# EAGLE design click sensor hub 2019 (EAGLE 9.3.0)

## Sheet 1 of 2
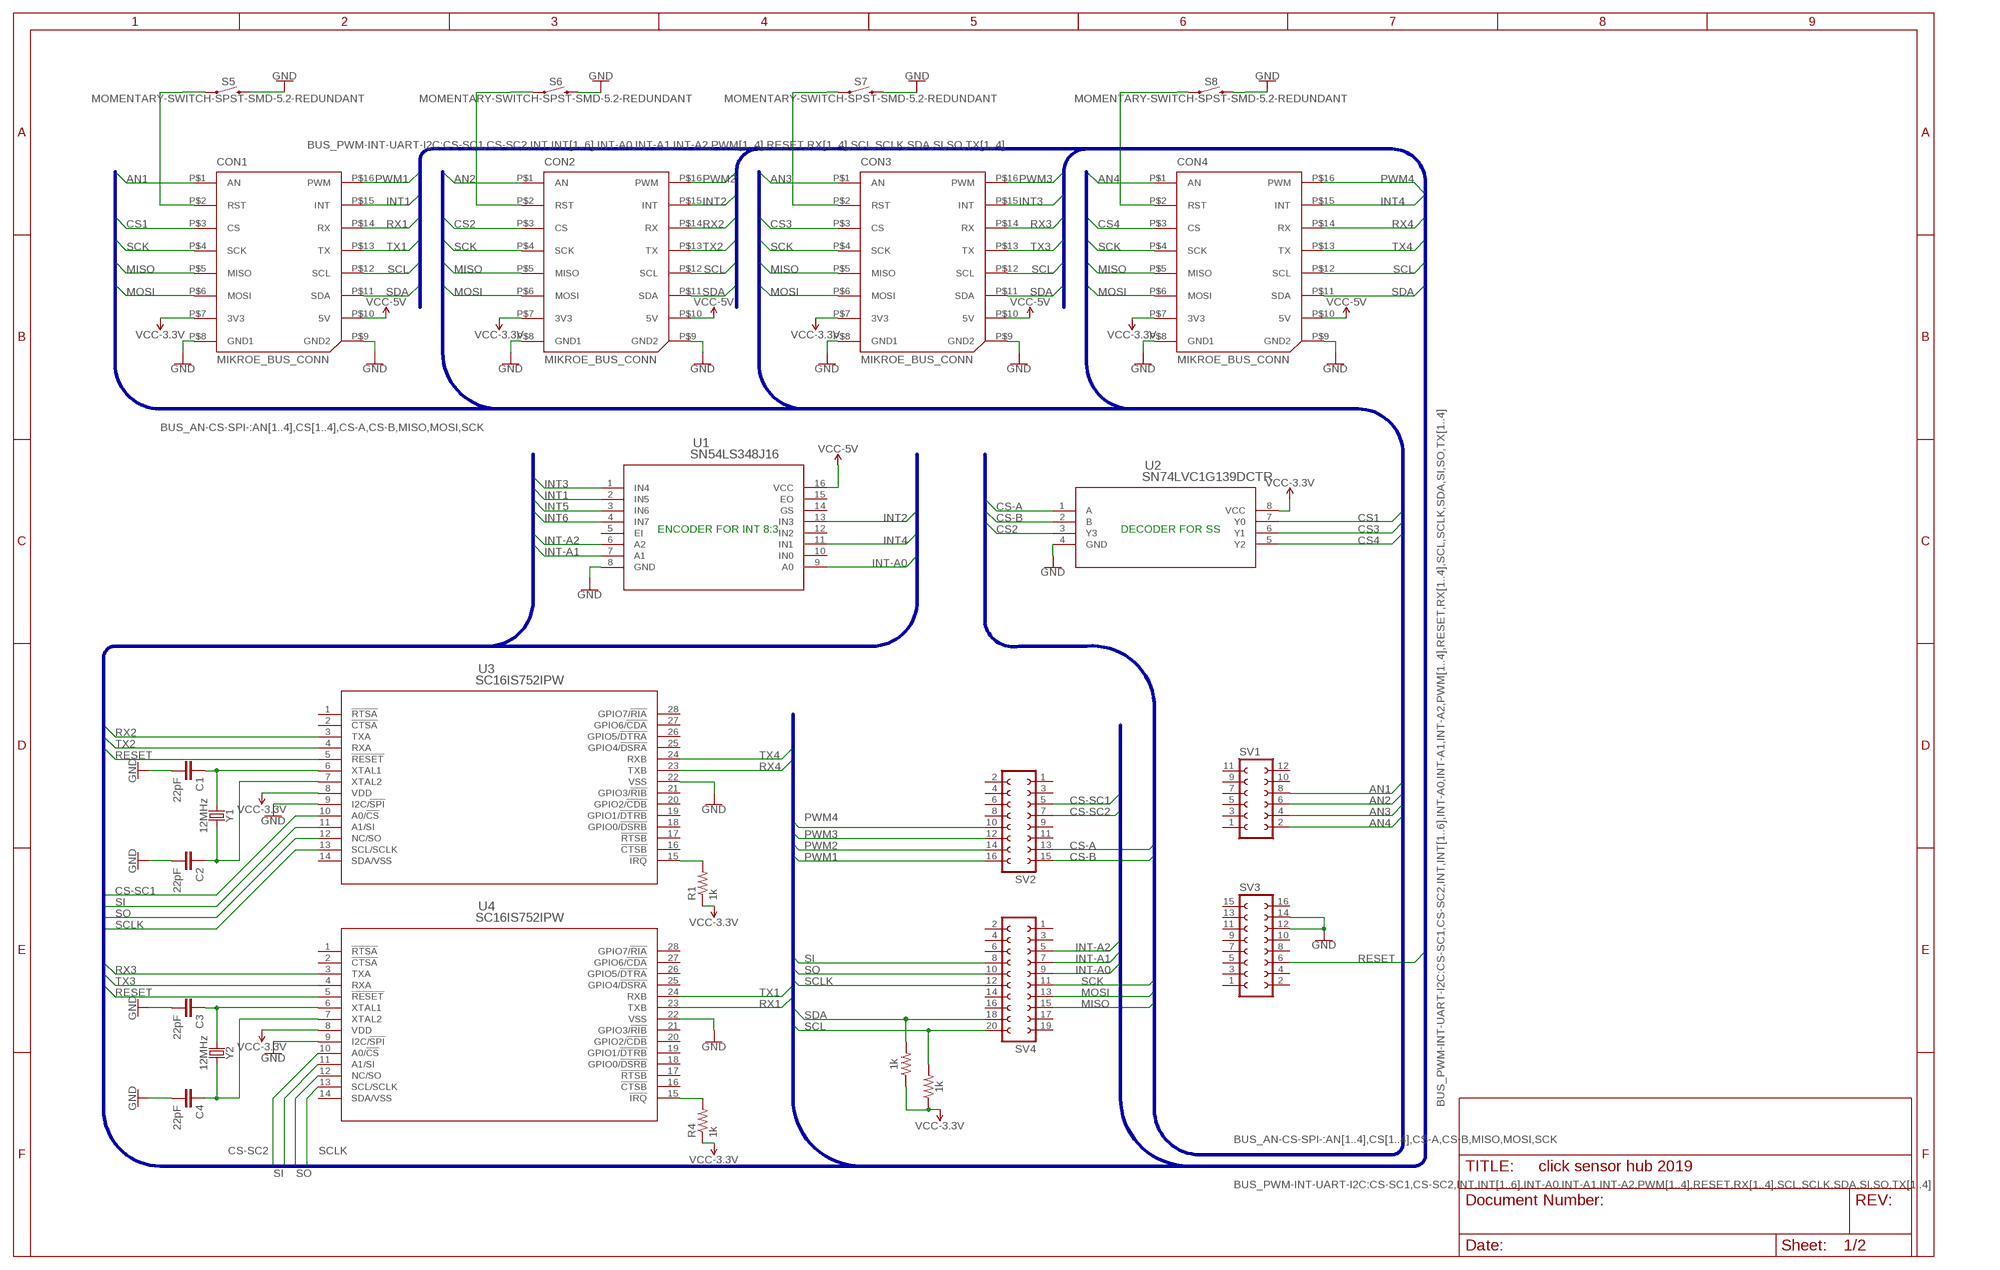
[diagram p0: schematic, sheet 1]

### Parts
C1  22pF  22PF-0603-50V-5%  [0603]
C2  22pF  22PF-0603-50V-5%  [0603]
C3  22pF  22PF-0603-50V-5%  [0603]
C4  22pF  22PF-0603-50V-5%  [0603]
CON1  MIKROE_BUS_CONN  [MIKROBUS_HOST_CONN]
CON2  MIKROE_BUS_CONN  [MIKROBUS_HOST_CONN]
CON3  MIKROE_BUS_CONN  [MIKROBUS_HOST_CONN]
CON4  MIKROE_BUS_CONN  [MIKROBUS_HOST_CONN]
R1  1k  R-US_R0805  [R0805]
R2  1k  R-US_R0805  [R0805]
R3  1k  R-US_R0805  [R0805]
R4  1k  R-US_R0805  [R0805]
S5  MOMENTARY-SWITCH-SPST-SMD-5.2-REDUNDANT  [TACTILE_SWITCH_SMD_5.2MM]
S6  MOMENTARY-SWITCH-SPST-SMD-5.2-REDUNDANT  [TACTILE_SWITCH_SMD_5.2MM]
S7  MOMENTARY-SWITCH-SPST-SMD-5.2-REDUNDANT  [TACTILE_SWITCH_SMD_5.2MM]
S8  MOMENTARY-SWITCH-SPST-SMD-5.2-REDUNDANT  [TACTILE_SWITCH_SMD_5.2MM]
SV1  FE06-2  [FE06-2]
SV2  FE08-2  [FE08-2]
SV3  FE08-2  [FE08-2]
SV4  FE10-2  [FE10-2]
U1  SN54LS348J16  [DIP16_300]
U2  SN74LVC1G139DCTR  [DCT8]
U3  SC16IS752IPW  [SOT361-1]
U4  SC16IS752IPW  [SOT361-1]
Y1  12MHz  CRYSTAL-12MHZ"  [CRYSTAL-SMD-5X3.2-4PAD]
Y2  12MHz  CRYSTAL-12MHZ"  [CRYSTAL-SMD-5X3.2-4PAD]

### Nets
3.3V: CON1.P$7(3V3) CON2.P$7(3V3) CON3.P$7(3V3) CON4.P$7(3V3) ; supply symbol labelled VCC-3.3V ; also sheet 2
5V: CON1.P$10(5V) CON2.P$10(5V) CON3.P$10(5V) CON4.P$10(5V) ; supply symbol labelled VCC-5V ; also sheet 2
AN1: CON1.P$1(AN) SV1.8
AN2: CON2.P$1(AN) SV1.6
AN3: CON3.P$1(AN) SV1.4
AN4: CON4.P$1(AN) SV1.2
CS1: CON1.P$3(CS) U2.7(Y0)
CS2: CON2.P$3(CS) U2.3(Y3)
CS3: CON3.P$3(CS) U2.6(Y1)
CS4: CON4.P$3(CS) U2.5(Y2)
CS-A: SV2.13 U2.1(A)
CS-B: SV2.15 U2.2(B)
CS-SC1: SV2.5 U3.10(A0/!CS)
CS-SC2: SV2.7 U4.10(A0/!CS)
GND: C1.2 C2.2 C3.2 C4.2 CON1.P$8(GND1) CON1.P$9(GND2) CON2.P$8(GND1) CON2.P$9(GND2) CON3.P$8(GND1) CON3.P$9(GND2) CON4.P$8(GND1) CON4.P$9(GND2) S5.3 S5.4 S6.3 S6.4 S7.3 S7.4 S8.3 S8.4 SV3.12 SV3.14 U1.8(GND) U2.4(GND) U3.9(I2C/!SPI) U3.22(VSS) U4.9(I2C/!SPI) U4.22(VSS) ; also sheet 2
INT1: CON1.P$15(INT) U1.2(IN5)
INT2: CON2.P$15(INT) U1.13(IN3)
INT3: CON3.P$15(INT) U1.1(IN4)
INT4: CON4.P$15(INT) U1.11(IN1)
INT5: R1.2 U1.3(IN6) U3.15(!IRQ)
INT6: R4.2 U1.4(IN7) U4.15(!IRQ)
INT-A0: SV4.9 U1.9(A0)
INT-A1: SV4.7 U1.7(A1)
INT-A2: SV4.5 U1.6(A2)
MISO: CON1.P$5(MISO) CON2.P$5(MISO) CON3.P$5(MISO) CON4.P$5(MISO) SV4.15
MOSI: CON1.P$6(MOSI) CON2.P$6(MOSI) CON3.P$6(MOSI) CON4.P$6(MOSI) SV4.13
N$8: C1.1 U3.6(XTAL1) Y1.1
N$9: C2.1 U3.7(XTAL2) Y1.3
N$10: C3.1 U4.6(XTAL1) Y2.1
N$11: CON4.P$2(RST) S8.1 S8.2
N$12: C4.1 U4.7(XTAL2) Y2.3
N$15: CON1.P$2(RST) S5.1 S5.2
N$16: CON2.P$2(RST) S6.1 S6.2
N$18: CON3.P$2(RST) S7.1 S7.2
PWM1: CON1.P$16(PWM) SV2.16
PWM2: CON2.P$16(PWM) SV2.14
PWM3: CON3.P$16(PWM) SV2.12
PWM4: CON4.P$16(PWM) SV2.10
RESET: SV3.6 U3.5(!RESET) U4.5(!RESET)
RX1: CON1.P$14(RX) U4.23(TXB)
RX2: CON2.P$14(RX) U3.3(TXA)
RX3: CON3.P$14(RX) U4.3(TXA)
RX4: CON4.P$14(RX) U3.23(TXB)
SCK: CON1.P$4(SCK) CON2.P$4(SCK) CON3.P$4(SCK) CON4.P$4(SCK) SV4.11
SCL: CON1.P$12(SCL) CON2.P$12(SCL) CON3.P$12(SCL) CON4.P$12(SCL) R3.2 SV4.20
SCLK: SV4.12 U3.13(SCL/SCLK) U4.13(SCL/SCLK)
SDA: CON1.P$11(SDA) CON2.P$11(SDA) CON3.P$11(SDA) CON4.P$11(SDA) R2.2 SV4.18
SI: SV4.8 U3.11(A1/SI) U4.11(A1/SI)
SO: SV4.10 U3.12(NC/SO) U4.12(NC/SO)
TX1: CON1.P$13(TX) U4.24(RXB)
TX2: CON2.P$13(TX) U3.4(RXA)
TX3: CON3.P$13(TX) U4.4(RXA)
TX4: CON4.P$13(TX) U3.24(RXB)
VCC: U1.16(VCC) U2.8(VCC) ; supply symbol labelled VCC-3.3V, VCC-5V
VDD: R1.1 R2.1 R3.1 R4.1 U3.8(VDD) U4.8(VDD) ; supply symbol labelled VCC-3.3V
Unconnected: SV1.1 SV1.3 SV1.5 SV1.7 SV1.9 SV1.10 SV1.11 SV1.12 SV2.1 SV2.2 SV2.3 SV2.4 SV2.6 SV2.8 SV2.9 SV2.11 SV3.1 SV3.2 SV3.3 SV3.4 SV3.5 SV3.7 SV3.8 SV3.9 SV3.10 SV3.11 SV3.13 SV3.15 SV3.16 SV4.1 SV4.2 SV4.3 SV4.4 SV4.6 SV4.14 SV4.16 SV4.17 SV4.19 U1.5(EI) U1.10(IN0) U1.12(IN2) U1.14(GS) U1.15(EO) U3.1(!RTSA) U3.2(!CTSA) U3.14(SDA/VSS) U3.16(!CTSB) U3.17(!RTSB) U3.18(GPIO0/!DSRB) U3.19(GPIO1/!DTRB) U3.20(GPIO2/!CDB) U3.21(GPIO3/!RIB) U3.25(GPIO4/!DSRA) U3.26(GPIO5/!DTRA) U3.27(GPIO6/!CDA) U3.28(GPIO7/!RIA) U4.1(!RTSA) U4.2(!CTSA) U4.14(SDA/VSS) U4.16(!CTSB) U4.17(!RTSB) U4.18(GPIO0/!DSRB) U4.19(GPIO1/!DTRB) U4.20(GPIO2/!CDB) U4.21(GPIO3/!RIB) U4.25(GPIO4/!DSRA) U4.26(GPIO5/!DTRA) U4.27(GPIO6/!CDA) U4.28(GPIO7/!RIA)

### Buses
BUS_PWM-INT-UART-I2C:CS-SC1,CS-SC2,INT,INT[1..6],INT-A0,INT-A1,INT-A2,PWM[1..4],RESET,RX[1..4],SCL,SCLK,SDA,SI,SO,TX[1..4]
BUS_AN-CS-SPI-:AN[1..4],CS[1..4],CS-A,CS-B,MISO,MOSI,SCK

### Notes on the sheet
- ENCODER FOR INT 8:3 | DECODER FOR SS

## Sheet 2 of 2
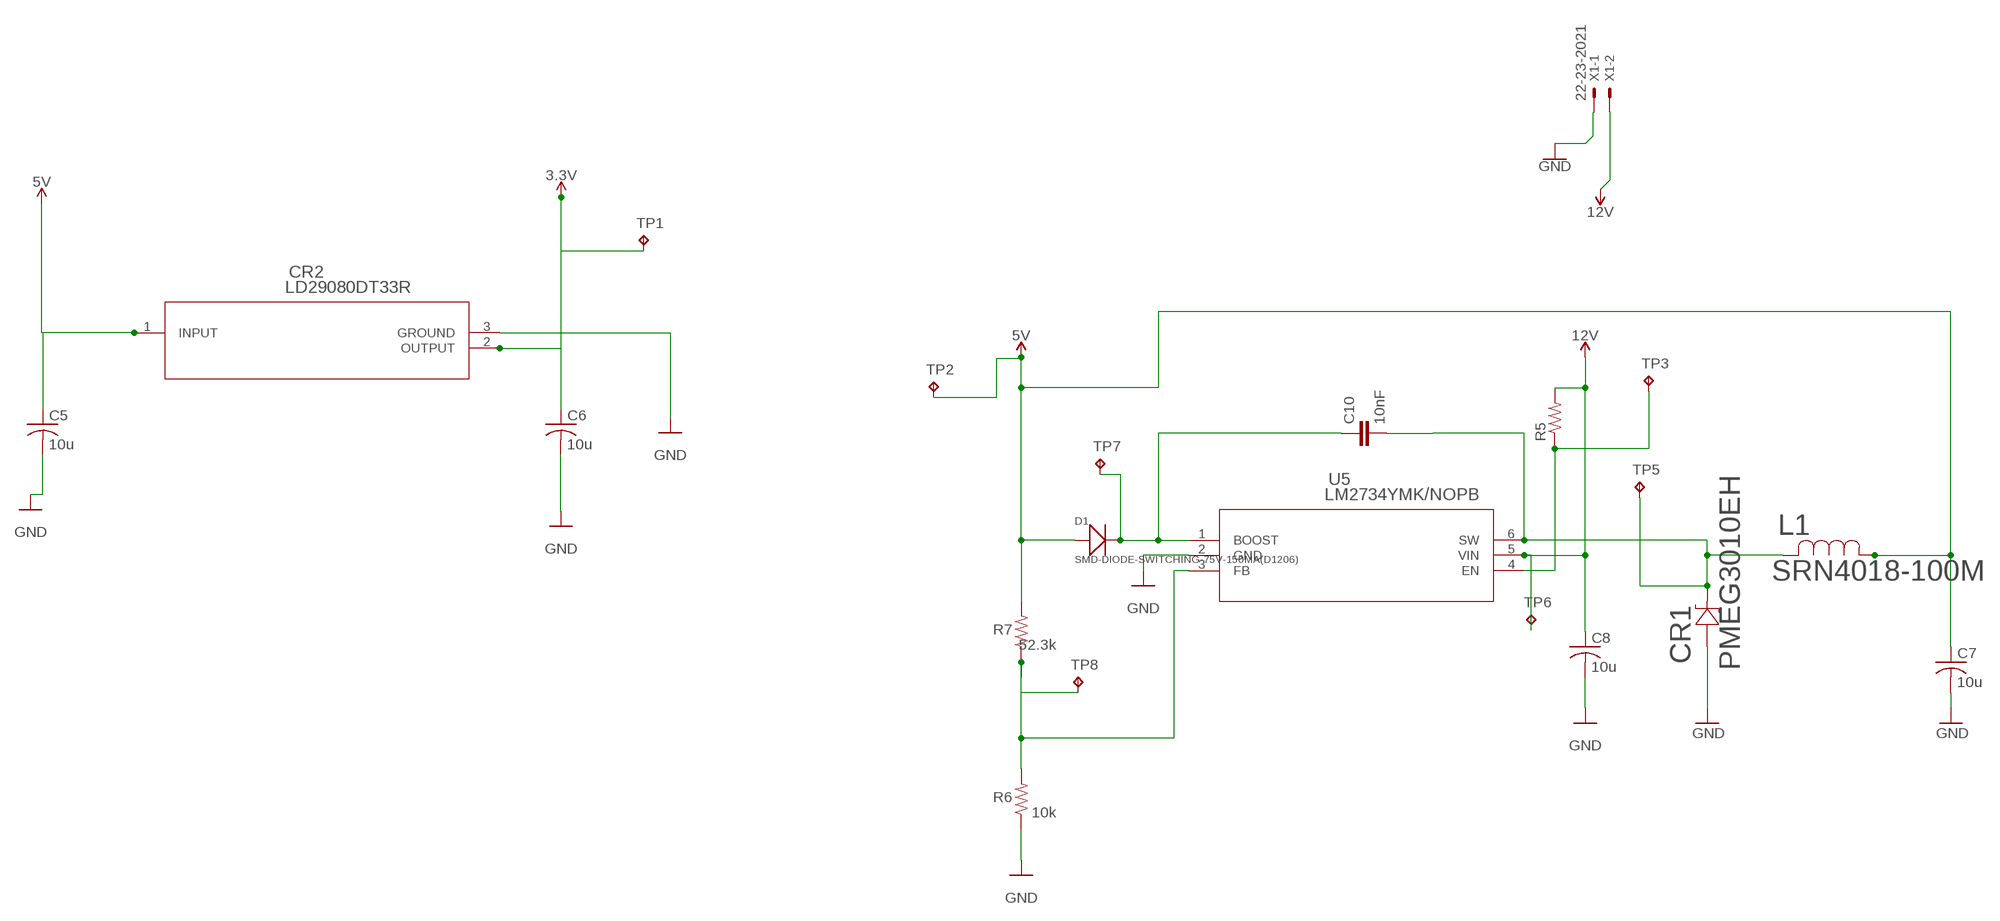
[diagram p1: schematic, sheet 2]

### Parts
C5  10u  C-USC0603K  [C0603K]
C6  10u  C-USC0603K  [C0603K]
C7  10u  C-USC0603K  [C0603K]
C8  10u  C-USC0603K  [C0603K]
C10  10nF  10NF-0603-50V-10%  [0603]
CR1  PMEG3010EH  [SOD123F]
CR2  LD29080DT33R  [DPAK]
D1  SMD-DIODE-SWITCHING-75V-150MA(D1206)  [LED-1206]
L1  SRN4018-100M  [IND_BOURNS_SRN4018]
R5  R-US_R0603  [R0603]
R6  10k  R-US_R0603  [R0603]
R7  52.3k  R-US_R0603  [R0603]
TP1  TPTP20SQ  [TP20SQ]
TP2  TPTP20SQ  [TP20SQ]
TP3  TPTP14SQ  [TP14SQ]
TP5  TPTP07SQ  [TP07SQ]
TP6  TPTP15SQ  [TP15SQ]
TP7  TPTP08SQ  [TP08SQ]
TP8  TPTP09SQ  [TP09SQ]
U5  LM2734YMK/NOPB  [MK06A]
X1  22-23-2021  [22-23-2021]

### Nets
3.3V: C6.1 CR2.2(OUTPUT) TP1.TP ; also sheet 1
5V: C5.1 C7.1 CR2.1(INPUT) D1.+ L1.1 R7.2 TP2.TP ; also sheet 1
12V: C8.1 R5.2 TP6.TP U5.5(VIN) X1.2
GND: C5.2 C6.2 C7.2 C8.2 CR1.2 CR2.3(GROUND) R6.1 U5.2(GND) X1.1 ; also sheet 1
N$1: R5.1 TP3.TP U5.4(EN)
N$3: C10.1 D1.- TP7.TP U5.1(BOOST)
N$4: R6.2 R7.1 TP8.TP U5.3(FB)
N$14: C10.2 CR1.1 L1.2 TP5.TP U5.6(SW)

## Library data of the parts
C1-C4 = SparkFun-Capacitors:22PF: 22pF ceramic capacitors A capacitor is a passive two-terminal electrical component used to store electrical energy temporarily in an electric field.; PROD_ID: CAP-07876
C5-C8 = rcl:C-US: CAPACITOR, American symbol; SPICEPREFIX: C
C10 = SparkFun-Capacitors:10NF: 0.01uF/10nF/10,000pF ceramic capacitors A capacitor is a passive two-terminal electrical component used to store electrical energy temporarily in an electric field. CAP-09321; PROD_ID: CAP-00867
CON1-CON4 = mikrobus_lib:MIKROE_BUS_CONN
CR1 = PMEG3010ER:PMEG3010EH: Schottky Diodes & Rectifiers; MANUFACTURER_PART_NUMBER: PMEG3010EH; VENDOR: Nexperia
CR2 = LD2908 DC to DC :LD29080DT33R; MANUFACTURER_PART_NUMBER: LD29080DT33R; VENDOR: STMicroelectronics
D1 = SMD-DIODE-SWITCHING-75V-150MA_D1206_:SMD-DIODE-SWITCHING-75V-150MA(D1206): 304040005; AVAILABILITY: Unavailable; DESCRIPTION: Diode Small Signal Switching 100V 0.15A 2-Pin Case 1206; MF: Bourns; MP: CD1206-S01575; PACKAGE: 1206 Bourns; PRICE: None
L1 = inductors DC DC:SRN4018-100M; MANUFACTURER_PART_NUMBER: SRN4018100M; VENDOR: Bourns Electronics
R1-R4 = adafruit:R-US_: RESISTOR, American symbol
R5-R7 = rcl:R-US_: RESISTOR, American symbol; SPICEPREFIX: R
S5-S8 = SparkFun-Switches:MOMENTARY-SWITCH-SPST: Momentary Switch (Pushbutton) - SPST Normally-open (NO) SPST momentary switches (buttons, pushbuttons). Variants PTH-12MM - 12mm square, through-hole Momentary Pushbutton Switch - 12mm Square <https://www.sparkfun.com/products/9190> (COM-09190) PTH-6.0MM, PTH-6.0MM-KIT - 6.0mm square, through-hole Mini Pushbutton Switch <https://www.sparkfun.com/products/97> (COM-00097) KIT package intended for soldering kit's - only one side of pads' copper is exposed. PTH-RIGHT-ANGLE-KIT - Right-angle, through-hole Right Angle Tactile Button <https://www.sparkfun.com/products/10791> - Used on SparkFun BigTime Watch Kit <https://www.sparkfun.com/products/11734> SMD-12MM - 12mm square, surface-mount Tactile Button - SMD (12mm) <https://www.sparkfun.com/products/12993> (COM-12993) Used on SparkFun PicoBoard <https://www.sparkfun.com/products/11888> SMD-4.5MM - 4.5mm Square Trackball Switch Used on SparkFun Blackberry Trackballer Breakout <https://www.sparkfun.com/products/13169> SMD-4.6MMX2.8MM - 4.60mm x 2.80mm, surface mount Used on SparkFun SAMD21 Mini Breakout <https://www.sparkfun.com/products/13664> SMD-5.2MM, SMD-5.2-REDUNDANT - 5.2mm square, surface-mount Mini Pushbutton Switch - SMD <https://www.sparkfun.com/products/8720> (COM-08720) Used on Arduino Pro Mini <https://www.sparkfun.com/products/11114> REDUNDANT package connects both switch circuits together SMD-6.0X3.5MM - 6.0 x 3.5mm, surface mount Momentary Reset Switch SMD <https://www.sparkfun.com/products/8229> (COM-08229) SMD-6.2MM-TALL - 6.2mm square, surface mount Tactile Button - SMD (6mm) <https://www.sparkfun.com/products/12992> Used on SparkFun Digital Sandbox <https://www.sparkfun.com/products/12651> SMD-RIGHT-ANGLE - Right-angle, surface mount Used on SparkFun Block for Intel® Edison - Arduino <https://www.sparkfun.com/products/13036>; PROD_ID: SWCH-08247; SF_SKU: COM-08720
SV1 = con-lsta:FE06-2: FEMALE HEADER; OC_FARNELL: unknown; OC_NEWARK: unknown
SV2 SV3 = con-lsta:FE08-2: FEMALE HEADER; OC_FARNELL: unknown; OC_NEWARK: unknown
SV4 = con-lsta:FE10-2: FEMALE HEADER; OC_FARNELL: unknown; OC_NEWARK: unknown
TP1-TP3 TP5-TP8 = testpad:TP: Test pad
U1 = Priority_Encoder:SN54LS348J16: Priority Encoder 8 to 3; MANUFACTURER_PART_NUMBER: SN54LS348J16; VENDOR: Texas Instruments
U2 = Decoder_2_4:SN74LVC1G139DCTR: Decoder 2:4; MANUFACTURER_PART_NUMBER: SN74LVC1G139DCTR; VENDOR: Texas Instruments
U3 U4 = SC16IS752IPWSOT:SC16IS752IPW: Bridge from SPI to UART; MANUFACTURER_PART_NUMBER: SC16IS752IPW; VENDOR: NXP
U5 = LM2744:LM2734YMK/NOPB: Voltage regulator 5v; MANUFACTURER_PART_NUMBER: LM2734YMKNOPB; VENDOR: Texas Instruments
X1 = con-molex:22-23-2021: .100" (2.54mm) Center Header - 2 Pin; MF: MOLEX; MPN: 22-23-2021; OC_FARNELL: 1462926; OC_NEWARK: 25C3832
Y1 Y2 = SparkFun-Clocks:CRYSTAL-12MHZ: 12.0MHz Crystal Frequency: 12.0MHz Frequency Tolerance: ±20ppm Load Capacitance: 18pF SparkFun Products: SparkFun Logomatic <https://www.sparkfun.com/products/12772> Pocket AVR Programmer <https://www.sparkfun.com/products/9825>; PROD_ID: XTAL-08297

## Net classes
0 default: width 0.305 mm, drill 0.508 mm, clearance 0.254 mm

## Board
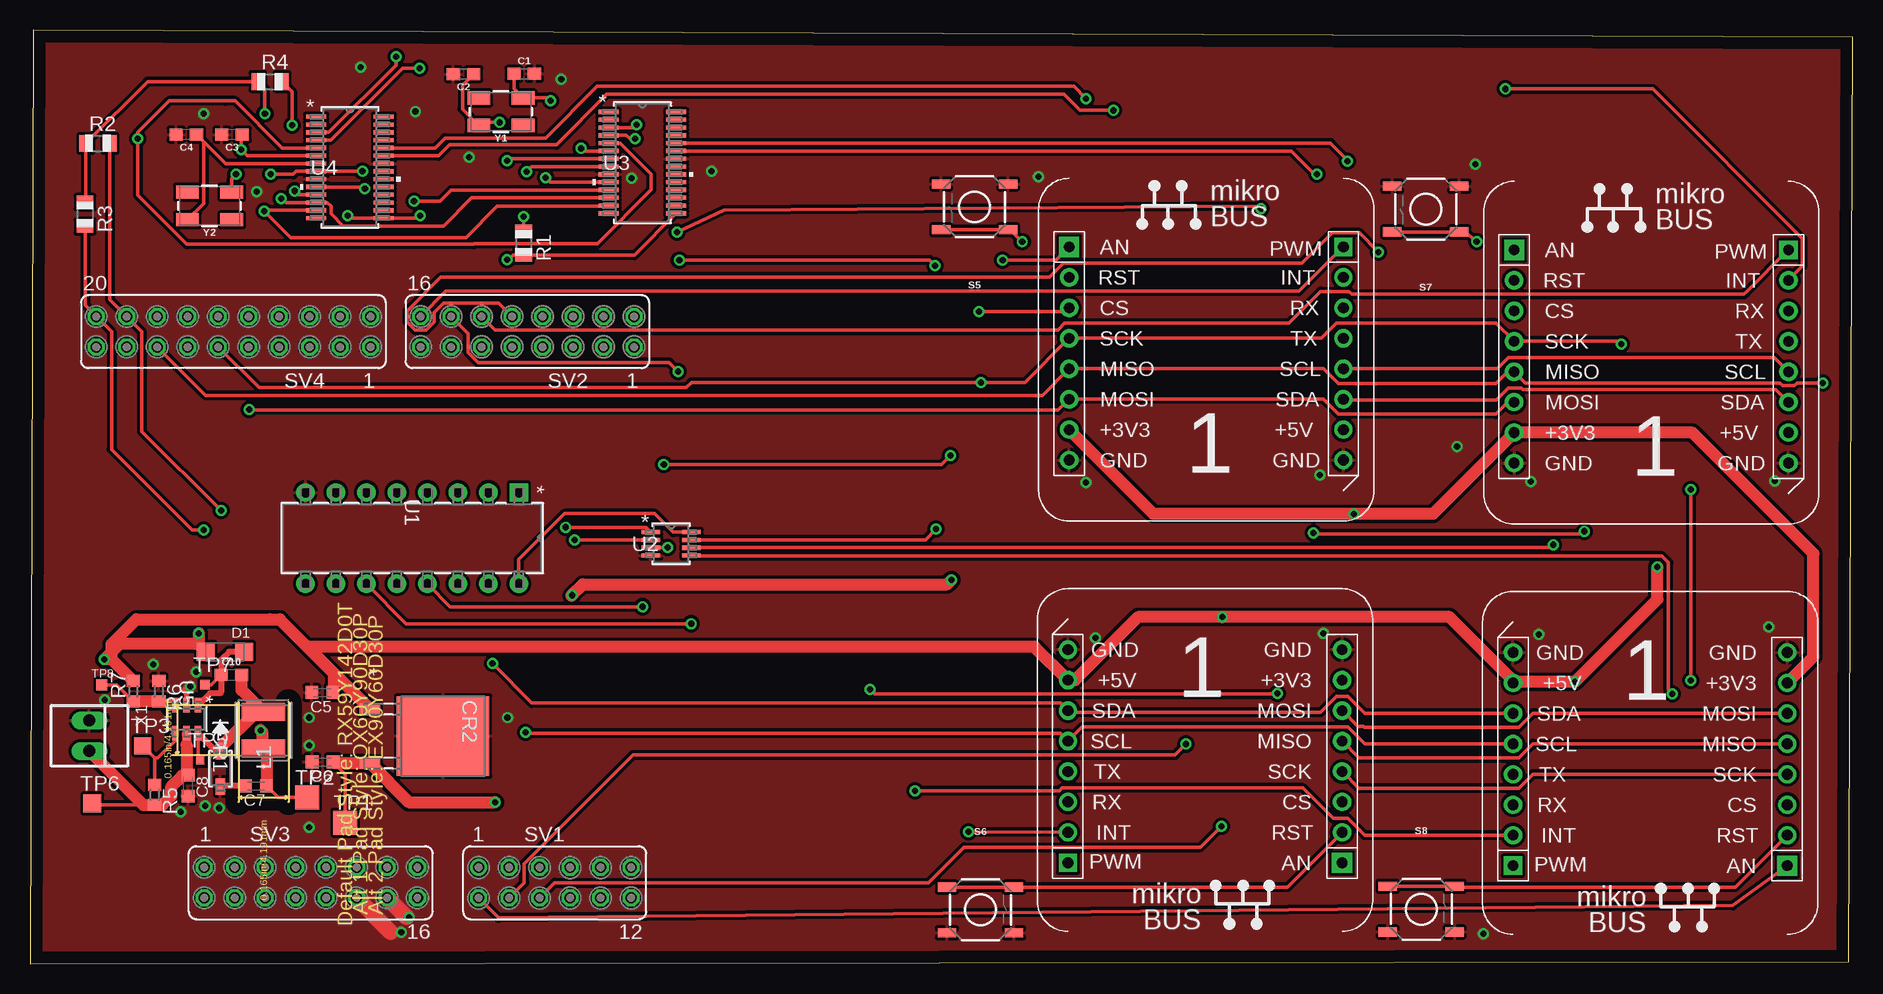
[diagram p2: board, top side]
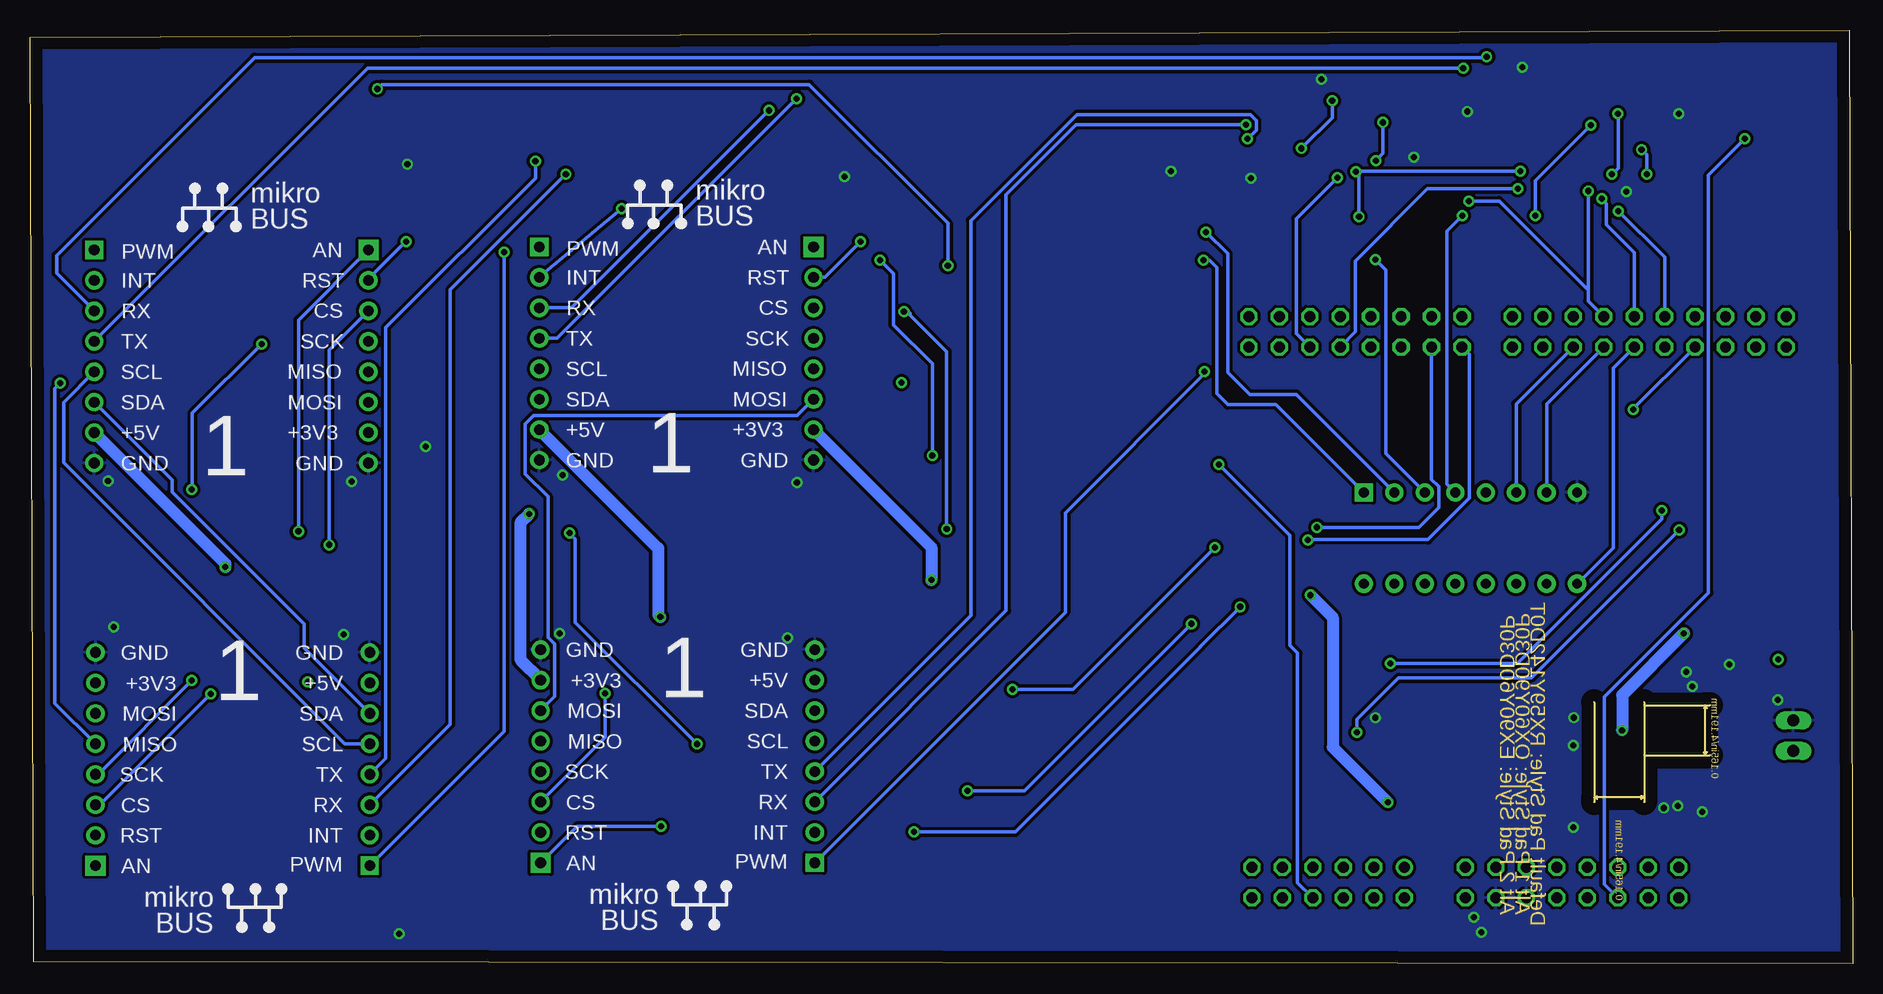
[diagram p3: board, bottom side, seen from below]

Size 151.94 x 77.84 mm. Coordinates in mm from the lower left corner, seen from the top.
Outline: 0,0 151.62,0.13 151.94,77.25 0.28,77.84 0,0
Copper layers (1*16): Top 0.035mm / dielectric 1.5mm / Bottom 0.035mm
Design rules "default": minimum track width 6mil, minimum drill 0.35mm, track to track 6mil, track to pad 6mil, pad to pad 6mil, via to via 6mil, smd to smd 6mil, copper to edge 40mil, drill to drill 6mil, minimum pad ring 10mil, minimum via ring 8mil, stop-mask expansion 4mil, vias tented up to drill 0mil, thermal gap 10mil

### Footprints (pad centres in the part's own frame; a part is rotated, then mirrored left to right if it is on the bottom)
0603 = smd 1.1 x 1: 1 -0.85,0; 2 0.85,0
C0603K = smd 1.05 x 1.08: 1 -0.875,0; 2 0.875,0
MIKROBUS_HOST_CONN = drill 0.889 pad 1.676 square: P$1 0,0 | drill 0.889 pad 1.524: P$2 0,-2.54; P$3 0,-5.08; P$4 0,-7.62; P$5 0,-10.16; P$6 0,-12.7; P$7 0,-15.24; P$8 0,-17.78; P$9 22.86,-17.78; P$10 22.86,-15.24; P$11 22.86,-12.7; P$12 22.86,-10.16; P$13 22.86,-7.62; P$14 22.86,-5.08; P$15 22.86,-2.54 | drill 0.889 pad 1.524 square: P$16 22.86,0
SOD123F = smd 1.372 x 0.762: 1 -1.473,0; 2 1.473,0
DPAK = smd 0.94 x 1.702: 1 -2.25,-6.109; 2 2.25,-6.109 | smd 6.655 x 7.722: 3 0,0
LED-1206 = smd 1.5 x 1.5: + -1.6,0; - 1.6,0
IND_BOURNS_SRN4018 = smd 1.499 x 3.607: 1 -1.524,0; 2 1.524,0
R0805 = smd 1.1 x 1.4: 1 -1,0; 2 1,0
R0603 = smd 1 x 1.1: 1 -0.85,0; 2 0.85,0
TACTILE_SWITCH_SMD_5.2MM = smd 1.524 x 0.762: 1 -2.794,1.905; 2 2.794,1.905; 3 -2.794,-1.905; 4 2.794,-1.905
FE06-2 = drill 0.914: 1 -6.35,1.27 | drill 0.914 octagon: 2 -6.35,-1.27; 3 -3.81,1.27; 4 -3.81,-1.27; 5 -1.27,1.27; 6 -1.27,-1.27; 7 1.27,1.27; 8 1.27,-1.27; 9 3.81,1.27; 10 3.81,-1.27; 11 6.35,1.27; 12 6.35,-1.27
FE08-2 = drill 0.914 octagon: 1 -8.89,1.27; 2 -8.89,-1.27; 3 -6.35,1.27; 4 -6.35,-1.27; 5 -3.81,1.27; 6 -3.81,-1.27; 7 -1.27,1.27; 8 -1.27,-1.27; 9 1.27,1.27; 10 1.27,-1.27; 11 3.81,1.27; 12 3.81,-1.27; 13 6.35,1.27; 14 6.35,-1.27; 15 8.89,1.27; 16 8.89,-1.27
FE10-2 = drill 0.914 octagon: 1 -11.43,1.27; 2 -11.43,-1.27; 3 -8.89,1.27; 4 -8.89,-1.27; 5 -6.35,1.27; 6 -6.35,-1.27; 7 -3.81,1.27; 8 -3.81,-1.27; 9 -1.27,1.27; 10 -1.27,-1.27; 11 1.27,1.27; 12 1.27,-1.27; 13 3.81,1.27; 14 3.81,-1.27; 15 6.35,1.27; 16 6.35,-1.27; 17 8.89,1.27; 18 8.89,-1.27; 19 11.43,1.27; 20 11.43,-1.27
TP20SQ = smd 2 x 2: TP 0,0
TP14SQ = smd 1.4 x 1.4: TP 0,0
TP07SQ = smd 0.7 x 0.7: TP 0,0
TP15SQ = smd 1.5 x 1.5: TP 0,0
TP08SQ = smd 0.8 x 0.8: TP 0,0
TP09SQ = smd 0.9 x 0.9: TP 0,0
DIP16_300 = drill 0.813 pad 1.524 square: 1 -7.62,17.78 | drill 0.813 pad 1.524: 2 -7.62,15.24; 3 -7.62,12.7; 4 -7.62,10.16; 5 -7.62,7.62; 6 -7.62,5.08; 7 -7.62,2.54; 8 -7.62,0; 9 0,0; 10 0,2.54; 11 0,5.08; 12 0,7.62; 13 0,10.16; 14 0,12.7; 15 0,15.24; 16 0,17.78
DCT8 = smd 1.562 x 0.356: 1 -1.695,0.975; 2 -1.695,0.325; 3 -1.695,-0.325; 4 -1.695,-0.975; 5 1.695,-0.975; 6 1.695,-0.325; 7 1.695,0.325; 8 1.695,0.975
SOT361-1 = smd 1.676 x 0.356: 1 -2.819,4.225; 2 -2.819,3.575; 3 -2.819,2.925; 4 -2.819,2.275; 5 -2.819,1.625; 6 -2.819,0.975; 7 -2.819,0.325; 8 -2.819,-0.325; 9 -2.819,-0.975; 10 -2.819,-1.625; 11 -2.819,-2.275; 12 -2.819,-2.925; 13 -2.819,-3.575; 14 -2.819,-4.225; 15 2.819,-4.225; 16 2.819,-3.575; 17 2.819,-2.925; 18 2.819,-2.275; 19 2.819,-1.625; 20 2.819,-0.975; 21 2.819,-0.325; 22 2.819,0.325; 23 2.819,0.975; 24 2.819,1.625; 25 2.819,2.275; 26 2.819,2.925; 27 2.819,3.575; 28 2.819,4.225
MK06A = smd 1.219 x 0.533: 1 -1.168,0.95; 2 -1.168,0; 3 -1.168,-0.95; 4 1.168,-0.95; 5 1.168,0; 6 1.168,0.95
22-23-2021 = drill 1 long: 1 -1.27,0; 2 1.27,0
CRYSTAL-SMD-5X3.2-4PAD = smd 1.9 x 1.1: 1 -1.85,-1.15; 2 1.85,-1.15; 3 1.85,1.15; 4 -1.85,1.15

### Placement (x,y rotation side)
C1  41.2,74.19 0 top
C2  36.13,74.17 180 top
C3  16.84,69.12 180 top
C4  13.03,69.12 180 top
C5  24.37,22.59 180 top
C6  24.39,16.8 180 top
C7  18.83,14.8 180 top
C8  13.17,14.84 270 top
C10  16.78,24.08 0 top
CON1  86.62,59.76 0 top
CON2  109.38,8.4 180 top
CON3  123.72,59.51 0 top
CON4  146.48,8.16 180 top
CR1  15.87,16.24 270 top
CR2  34.42,18.96 270 top
D1  16.23,25.99 0 top
L1  19.46,19.45 90 top
R1  41.14,60.07 270 top
R2  5.66,68.39 0 top
R3  4.59,62.47 270 top
R4  20.01,73.53 0 top
R5  10.39,14.06 270 top
R6  10.74,22.7 270 top
R7  8.61,22.7 90 top
S5  78.75,63.09 180 top
S6  79.23,4.47 0 top
S7  116.34,62.91 180 top
S8  115.96,4.54 0 top
SV1  43.74,6.74 0 top
SV2  41.45,52.68 180 top
SV3  23.4,6.74 0 top
SV4  16.95,52.68 180 top
TP1  26.29,11.74 0 top
TP2  23.09,13.84 0 top
TP3  9.39,18.14 0 top
TP5  14.19,16.94 0 top
TP6  5.19,13.34 0 top
TP7  14.59,23.24 0 top
TP8  5.99,23.24 0 top
U1  22.97,31.66 270 top
U2  53.44,35 0 top
U3  51.05,66.78 0 top
U4  26.67,66.38 0 top
U5  13.05,20.37 270 top
X1  4.95,18.99 270 top
Y1  39.26,71.03 180 top
Y2  14.97,63.17 180 top

### Tracks (layer width: path | path; a pad name or v marks a point on that pad's centre or on a via)
3.3V  (via drill 0.51)
  Top 0.305: TP1.TP 26.29,15.79 C6.1 25.36,16.71
  Top 1.002: 46.08,31.62 45.12,30.66 45.14,30.66 v45.19,30.71
  Top 1.016: CON1.P$7 93.64,37.5 v110.34,37.5 116.95,37.5 CON3.P$7 138.58,44.27 148.66,34.19 148.66,25.58 CON4.P$7 | 46.08,31.62 76.45,31.62 v76.8,31.97 | v38.76,13.45 31.58,13.45 CR2.2 25.36,16.71
  Bottom 1.002: CON1.P$7 79.74,37.64 | v45.19,30.71 43.34,28.86 43.34,18.03 v38.76,13.45
  Bottom 1.016: CON2.P$7 111.03,25.29 111.03,36.81 v110.34,37.5 | 79.74,37.64 76.8,34.7 v76.8,31.97
5V  (via drill 0.51)
  Top 0.305: 25.25,24.29 20.83,28.7 | 23.12,26.41 23.03,26.5 | TP2.TP 20.67,13.84 C7.1
  Top 0.8: 25.25,24.29 C5.1
  Top 1.002: CR2.1 23.03,26.5 20.83,28.7
  Top 1.016: 123.71,23.49 v128.77,23.49 135.66,30.38 v135.66,33.06 | 123.71,23.49 CON4.P$10 | 123.71,23.49 118.32,28.89 v99.4,28.89 92.37,28.89 87.12,23.64 CON2.P$10 83.74,26.41 28.58,26.41 23.12,26.41 | R7.2 6.79,25.37 | 6.79,25.37 v6.19,25.37 7.47,26.65 13.97,26.65 14.06,26.56 | C7.1 19.71,17.69 L1.1 19.46,18.09 19.35,18.2 19.35,19.31 v19.22,19.44 | v14.06,27.53 14.06,26.56 | 14.06,26.56 D1.+ | 6.79,25.37 6.79,26.63 8.86,28.7 19.99,28.7 20.83,28.7
  Bottom 1.016: CON1.P$10 99.57,34.61 99.57,29.07 v99.4,28.89 | CON3.P$10 135.66,33.35 v135.66,33.06 | v19.22,19.44 19.22,22.37 v14.06,27.53
12V
  Top 0.305: TP6.TP 5.32,13.21 R5.2
  Top 0.5: 12.9,15.72 C8.1 | 13.05,15.87 12.9,15.72 | 12.9,15.72 12.84,15.66
  Top 0.8: U5.5 13.05,18.23
  Top 1: 13.05,18.23 13.05,15.87
  Top 1.016: X1.2 9.45,13.21 R5.2 11.02,13.21 11.77,13.96 11.77,14.76 12.67,15.66 12.84,15.66
AN1  (via drill 0.51)
  Top 0.305: v52.83,41.61 75.97,41.61 v76.72,42.36 | v81.08,58.64 85.51,58.64 CON1.P$1
  Bottom 0.305: v52.83,41.61 46.91,35.69 46.91,26.52 46.28,25.89 46.28,6.74 SV1.8 | v76.72,42.36 76.72,50.01 79.96,53.25 79.96,57.53 v81.08,58.64
AN2  (via drill 0.51)
  Top 0.305: SV1.6 43.74,6.74 74.9,6.74 77.86,9.7 97.58,9.7 v99.32,11.44
  Bottom 0.305: v99.32,11.44 106.34,11.44 CON2.P$1
AN3  (via drill 0.51)
  Top 0.305: v129.56,36.04 129.33,35.81 107.05,35.81 v106.96,35.9 | SV1.4 41.2,6.74 41.2,8.32 50.27,17.39 95.44,17.39 v96.35,18.3
  Bottom 0.305: v129.56,36.04 129.56,53.67 CON3.P$1 | v96.35,18.3 106.48,28.43 106.48,35.42 v106.96,35.9
AN4
  Top 0.305: CON4.P$1 141.96,4.85 39.06,3.8 SV1.2
CS1  (via drill 0.51)
  Top 0.305: v79.1,54.37 86.31,54.37 CON1.P$3 | U2.7 74.63,35.33 v75.52,36.22
  Bottom 0.305: v79.1,54.37 78.59,54.21 78.57,54.08 75.52,51.03 v75.52,36.22
CS2  (via drill 0.51)
  Top 0.305: U2.3 v53.16,34.68 | v70.03,22.85 70.41,22.47 103.92,22.47 v103.99,22.54
  Bottom 0.305: v103.99,22.54 103.99,18.86 CON2.P$3 | v53.16,34.68 64.98,22.85 v70.03,22.85
CS3  (via drill 0.51)
  Top 0.305: v126.99,34.92 126.75,34.68 U2.6
  Bottom 0.305: CON3.P$3 126.99,51.15 v126.99,34.92
CS4  (via drill 0.51)
  Top 0.305: v136.89,22.49 136.57,22.8 136.57,33.44 136.03,33.97 55.19,33.97 U2.5
  Bottom 0.305: v136.89,22.49 146.13,13.24 CON4.P$3
CS-A  (via drill 0.51)
  Top 0.305: v44.65,36.38 51.34,36.38 U2.1
  Bottom 0.305: SV2.13 35.1,40.37 34.5,39.77 34.5,38.05 36.17,36.38 v44.65,36.38
CS-B  (via drill 0.51)
  Top 0.305: U2.2 v45.4,35.33
  Bottom 0.305: SV2.15 31.96,50.81 31.96,38.8 35.41,35.35 45.38,35.35 v45.4,35.33
CS-SC1  (via drill 0.51)
  Top 0.305: U3.10 43.35,65.15 v42.97,65.54
  Bottom 0.305: SV2.5 46.38,52.53 46.38,62.12 v42.97,65.54
CS-SC2  (via drill 0.51)
  Top 0.305: U4.10 27.76,64.75 v27.91,64.6
  Bottom 0.305: SV2.7 41.45,52.68 41.45,58.58 35.44,64.6 v27.91,64.6
GND  (via drill 0.51)
  Top 0.305: 23.52,17.05 C6.2
  Top 0.4: U5.2 13.05,22.79
  Top 0.5: C7.2 15.91,14.8 CR1.2 | v31.59,3.84 31.38,3.84
  Top 0.8: v30.95,2.62 30.06,2.62 | 13.05,22.79 v13.36,23.1
  Top 1.3: 30.06,2.62 SV3.12 | 31.38,3.84 SV3.14
  other vias: 44.29,73.74 56.82,66.07 125.77,27.46 88.8,27.16 88.02,40.12 125.11,40.21 145.43,40.23 107.52,40.73 107.8,27.52 144.95,28.07 120.48,66.66 84.05,65.59 121.15,2.49 27.55,74.74 50.15,65.47 12.55,12.64 10.28,24.95 13.86,24.32 6.24,21.98 15.75,12.96 32.12,71.04 118.96,43.12 39.79,20.5 23.25,20.5 23.27,18.19 36.59,67.24 14.49,70.84 18.89,64.34 14.59,13.14 23.29,11.34
  pour Top: -0.69,77.43 -0.69,-0.28 151.79,-0.28 151.79,77.43
  pour Bottom: -0.73,77.52 -0.73,-0.16 151.7,-0.16 151.7,77.52
INT1  (via drill 0.51)
  Top 0.305: v53.92,60.99 57.84,62.82 102.36,63.16 v102.62,62.95
  Bottom 0.305: CON1.P$15 v102.62,62.95 | U1.2 46.38,47.45 50.24,47.45 52.08,49.29 52.08,59.17 53.9,60.99 v53.92,60.99
INT2  (via drill 0.51)
  Top 0.305: CON2.P$15 v78.24,10.98 | v51.06,29.75 35.04,29.75 U1.13
  Bottom 0.305: v51.06,29.75 54.37,26.44 54.37,26.41 69.79,10.98 v78.24,10.98
INT3  (via drill 0.51)
  Top 0.305: v75.43,58.2 74.98,58.65 v54.13,58.65 | v122.98,72.92 135.26,72.92 147.75,60.44 147.75,58.14 CON3.P$15
  Bottom 0.305: v75.43,58.2 75.43,61.72 86.99,73.28 122.62,73.28 v122.98,72.92 | U1.1 48.06,46.59 52.09,46.59 53,47.5 53,58.02 53.63,58.65 v54.13,58.65
INT4  (via drill 0.51)
  Top 0.305: v55.12,28.34 31.37,28.34 U1.11 | CON4.P$15 111.27,10.7 109.86,12.11 108.62,12.11 106.08,14.65 86.03,14.65 85.79,14.41 v73.79,14.41
  Bottom 0.305: v73.79,14.41 69.05,14.41 v55.12,28.34
INT5  (via drill 0.51)
  Top 0.305: U3.15 50.39,59.07 R1.2 40.29,59.07 39.9,58.68 v39.78,58.68
  Bottom 0.305: U1.3 38.91,42.52 38.91,57.82 | 38.91,57.82 39.13,58.04 | 39.13,58.04 v39.78,58.68 | 38.91,57.82 39.13,58.04
INT6  (via drill 0.51)
  Top 0.305: v26.47,62.36 26.69,62.15 U4.15 32.32,62.15 v32.54,62.36 | R4.2 21.84,72.7 v21.84,69.91
  Bottom 0.305: v26.47,62.36 26.47,65.28 v21.84,69.91 | v32.54,62.36 33.83,61.07 33.83,39.98 U1.4
INT-A0
  Bottom 0.305: SV4.9 19.97,49.67 19.97,34.66 U1.9
INT-A1
  Bottom 0.305: SV4.7 25.51,46.67 U1.7
INT-A2
  Bottom 0.305: SV4.5 28.05,46.67 U1.6
MISO  (via drill 0.51)
  Top 0.305: CON2.P$5 110.78,17.15 124.1,17.15 125.27,18.32 CON4.P$5 | v149.42,48.41 147.29,48.41 147.06,48.18 146.09,48.18 145.86,48.41 124.65,48.41 CON3.P$5 123.18,49.35 122.17,48.34 109.08,48.34 107.83,49.6 CON1.P$5 84.39,47.37 14.65,47.37 SV4.15
  Bottom 0.305: v149.42,48.41 149.63,48.21 149.63,48.18 149.85,47.95 149.85,21.7 CON4.P$5
MOSI  (via drill 0.51)
  Top 0.305: CON4.P$6 125.27,20.86 124.1,19.69 111.23,19.69 111.15,19.78 110.7,19.78 CON2.P$6 | CON3.P$6 123.18,46.81 122.17,45.8 109.08,45.8 107.83,47.06 CON1.P$6 85.69,46.13 18.41,46.13 18.29,46 v18.29,46.21
  Bottom 0.305: v18.29,46.21 18.29,46.27 SV4.13 | CON1.P$6 87.99,45.68 109.96,45.68 110.65,45 110.65,40.83 108.75,38.93 108.75,27.21 108.21,26.66 108.21,22.27 CON2.P$6
N$1
  Top 0.305: U5.4 12.1,18.58 10.66,17.14 10.39,17.14 | R5.1 10.39,17.14 | 10.39,17.14 TP3.TP
N$3
  Top 0.305: TP7.TP 15.09,23.24 C10.1
  Top 0.5: D1.- 16.58,25.99 15.93,25.34 C10.1 15.93,22.59 15.89,22.54 15.01,22.54 | 15.01,22.54 U5.1 | 15.01,22.54
N$4
  Top 0.305: U5.3 11.79,21.85 R6.2 | TP8.TP 7.23,23.24 R7.1
  Top 1.016: R6.2 R7.1
N$8  (via drill 0.51)
  Top 0.305: U3.6 46.15,67.75 45.95,67.95 v45.95,67.96 | v43.39,71.94 43.15,72.18 Y1.1 40.35,72.95 C1.1
  Bottom 0.305: v45.95,67.96 43.39,70.52 v43.39,71.94
N$9  (via drill 0.51)
  Top 0.305: v39.15,70.13 37.86,70.13 37.6,69.88 Y1.3 36.06,71.24 36.06,73.24 C2.1 | U3.7 39.91,67.1 v39.76,66.95
  Bottom 0.305: v39.76,66.95 39.15,67.55 v39.15,70.13
N$10  (via drill 0.51)
  Top 0.305: C3.1 17.6,69.03 v17.6,67.87 18.12,67.35 U4.6 | Y2.1 16.82,65.46 v17.17,65.81
  Bottom 0.305: v17.17,65.81 17.17,67.44 v17.6,67.87
N$11
  Top 0.305: CON4.P$2 142.13,6.36 118.84,6.36 S8.2 S8.1
N$12
  Top 0.305: U4.7 16.3,66.7 C4.1 14.48,68.52 14.48,63.37 Y2.3
N$14
  Top 0.305: TP5.TP 14,17.13 U5.6
  Top 0.5: CR1.1 15.49,17.72 U5.6
  Top 1.016: C10.2 17.63,22.81 L1.2 18.88,20.98 15.87,17.97 CR1.1
N$15  (via drill 0.51)
  Top 0.305: S5.2 S5.1 81.7,61.19 v82.71,60.18
  Bottom 0.305: v82.71,60.18 85.67,57.22 CON1.P$2
N$16
  Top 0.305: CON2.P$2 104.81,6.37 S6.1 S6.2
N$18  (via drill 0.51)
  Top 0.305: S7.2 S7.1 119.2,61.07 119.62,61.07 120.5,60.19 v120.59,60.19
  Bottom 0.305: v120.59,60.19 120.61,60.21 123.72,57.1 CON3.P$2
PWM1
  Top 0.305: CON1.P$16 105.77,56.05 34.66,56.05 SV2.16
PWM2  (via drill 0.51)
  Top 0.305: SV2.14 36.53,52.53 36.53,50.95 37.35,50.13 53.28,50.13 v54.03,49.37
  Bottom 0.305: CON2.P$16 65.64,29.28 65.64,37.57 54.03,49.17 v54.03,49.37
PWM3
  Top 0.305: CON3.P$16 143.1,56.03 142.87,55.8 110.17,55.8 109.94,56.03 107.57,56.03 104.95,53.41 86.24,53.41 85.67,52.84 38.76,52.84 SV2.12
PWM4  (via drill 0.51)
  Top 0.305: SV2.10 39.07,55.07 34.47,55.07 33.68,54.28 33.68,53.49 33.03,52.84 32.1,52.84 31.45,53.49 31.45,54.42 34.24,57.22 84.97,57.22 86.13,58.38 106.01,58.38 108.55,60.92 110.79,60.92 v112.4,59.32
  Bottom 0.305: v112.4,59.32 112.4,19.37 CON4.P$16
RESET  (via drill 0.51)
  Top 0.305: U4.5 21.03,68 17.09,71.94 16.31,71.94 11.61,71.94 8.99,69.32 v8.99,68.76 8.99,64.07 13.08,59.98 36.99,59.98 37.03,60.02 47.29,60.02 51.78,64.5 51.78,65.8 49.17,68.4 U3.5
  Bottom 0.305: SV3.6 20.71,6.59 20.71,22.22 12.02,30.91 12.02,65.73 v8.99,68.76
RX1  (via drill 0.51)
  Top 0.305: v90.33,71.13 87.53,71.13 86.2,72.46 48.07,72.46 43.88,68.27 34.97,68.27 34.05,67.35 U4.23
  Bottom 0.305: v90.33,71.13 106.78,54.68 CON1.P$14
RX2  (via drill 0.51)
  Top 0.305: U3.3 50.34,69.7 v50.57,69.93
  Bottom 0.305: v50.57,69.93 64.73,69.93 70.57,64.09 70.57,29.42 CON2.P$14
RX3  (via drill 0.51)
  Top 0.305: U4.3 24.9,69.3 30.52,74.92 v30.52,75.62
  Bottom 0.305: v30.52,75.62 30.6,75.53 133.23,75.53 149.73,59.03 149.73,57.58 CON3.P$14
RX4  (via drill 0.51)
  Top 0.305: U3.23 105.14,67.75 107.07,65.82 v107.27,65.82
  Bottom 0.305: v107.27,65.82 116.91,56.18 116.91,19.95 CON4.P$14
SCK  (via drill 0.51)
  Top 0.305: CON4.P$4 125.27,15.78 124.1,14.61 110.78,14.61 CON2.P$4 | v132.63,51.66 132.4,51.89 131.44,51.89 CON3.P$4 122.21,53.4 108.91,53.4 107.65,52.14 CON1.P$4 82.94,48.45 v79.27,48.45 55.13,48.45 54.69,48.01 19.09,48.01 SV4.11 | v138.45,39.52 v138.45,23.6
  Bottom 0.305: v132.63,51.66 138.4,45.9 138.4,39.57 v138.45,39.52 | v138.45,23.6 146.27,15.78 CON4.P$4
SCL  (via drill 0.51)
  Top 0.305: R3.2 4.59,54.89 SV4.20 6.79,52.68 6.79,42.87 13.51,36.15 v14.47,36.15 | CON3.P$12 145.41,50.52 123.23,50.52 122.31,49.6 CON1.P$12 | CON4.P$12 111.27,18.32 109.86,19.73 87.69,19.73 CON2.P$12 85.89,19.19 41.4,19.19 v41.31,19.27
  Bottom 0.305: CON3.P$12 149.14,46.78 149.14,41.76 125.7,18.32 CON4.P$12 | v41.31,19.27 41.31,20.37 37.85,23.83 26.79,23.83 v14.47,36.15
SCLK  (via drill 0.51)
  Top 0.305: U4.13 19.59,62.8 v19.53,62.74 21.73,60.54 36.35,60.54 38.96,63.15 48.18,63.15 U3.13
  Bottom 0.305: v19.53,62.74 15.68,58.89 SV4.12
SDA  (via drill 0.51)
  Top 0.305: R2.2 6.66,55.36 SV4.18 9.33,52.68 9.33,44.37 v15.92,37.77 | CON1.P$11 109.56,46.97 122.23,46.97 123.23,47.98 124.3,47.98 124.42,47.85 145.53,47.85 CON3.P$11 | CON4.P$11 111.27,20.86 109.86,22.27 108.89,22.27 107.57,20.95 86.67,20.95 CON2.P$11 85.89,21.73 41.83,21.73 v38.54,25.01
  Bottom 0.305: CON4.P$11 129.08,26.32 129.08,28.32 140.09,39.33 140.09,40.32 CON3.P$11 | v15.92,37.77 15.92,37.05 27.96,25.01 v38.54,25.01
SI  (via drill 0.51)
  Top 0.305: U4.11 22.37,64.1 v22.05,64.42 | U3.11 35.11,64.5 34.19,63.58 v32,63.58
  Bottom 0.305: v22.05,64.42 22.05,56.14 | 22.05,56.14 22.05,55.24 SV4.8 | 22.05,56.14 24.59,58.68 24.56,58.68 29.46,63.58 v32,63.58
SO  (via drill 0.51)
  Top 0.305: v20.93,63.76 21.06,63.76 21.36,63.45 U4.12 24.79,63.45 25.1,63.15 25.1,62.51 26.11,61.5 34.48,61.5 36.83,63.85 U3.12
  Bottom 0.305: v20.93,63.76 20.55,63.38 20.55,61.6 18.22,59.28 SV4.10
TX1  (via drill 0.51)
  Top 0.305: v88.03,72.1 87,73.13 47.27,73.13 42.97,68.83 34.59,68.83 33.76,68 U4.24
  Bottom 0.305: v88.03,72.1 108,52.14 CON1.P$13
TX2  (via drill 0.51)
  Top 0.305: U3.4 49.69,69.05 49.71,69.07 50.01,68.76 v50.44,68.76
  Bottom 0.305: v50.44,68.76 49.71,69.5 49.71,70.29 50.21,70.79 64.66,70.79 73.51,61.94 73.51,29.02 CON2.P$13
TX3  (via drill 0.51)
  Top 0.305: U4.4 25.06,68.65 31.06,74.65 v32.47,74.65
  Bottom 0.305: v32.47,74.65 32.49,74.66 123.8,74.66 CON3.P$13
TX4  (via drill 0.51)
  Top 0.305: U3.24 108.4,68.4 109.81,66.99 v109.81,66.89
  Bottom 0.305: v109.81,66.89 109.81,65.47 122.27,53.01 122.27,17.13 CON4.P$13
VCC
  Top 0.305: U1.16 40.75,33.7 44.57,37.52 52.07,37.52 53.61,35.98 U2.8
VDD  (via drill 0.51)
  Top 0.305: v41.15,62.26 v41.14,62.26 R1.1 | R3.1 4.66,63.55 R2.1 9.81,73.53 R4.1 19.58,72.96 v19.58,70.85 | v20.06,65.82 21.94,65.82 22.18,66.05 U4.8 27.33,66.05 27.35,66.07 v27.71,66.07 | U3.8 41.81,66.45 v41.4,66.04
  Bottom 0.305: v41.15,62.26 41.17,62.29 41.17,65.81 v41.4,66.04 41.36,66.07 v27.71,66.07 | v19.58,70.85 19.56,70.85 19.56,66.3 20.04,65.82 v20.06,65.82